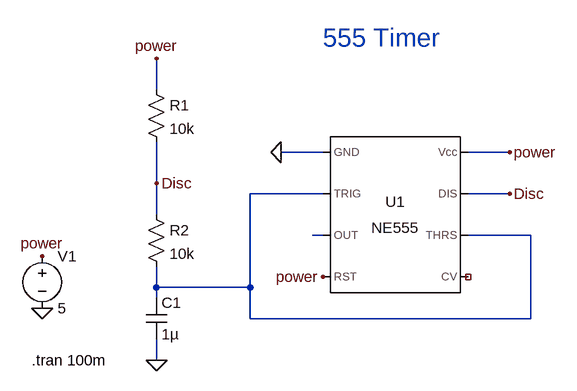
[diagram p0: schematic 555-timer.asc]
555-timer.asc, the LTspice schematic file:
Version 4.1
SHEET 1 880 680
WIRE -48 -16 -48 -64
WIRE 208 80 144 80
WIRE 496 80 432 80
WIRE -48 128 -48 64
WIRE 208 144 96 144
WIRE 496 144 432 144
WIRE -48 176 -48 128
WIRE 208 208 192 208
WIRE 528 208 432 208
WIRE -48 288 -48 256
WIRE 96 288 96 144
WIRE 96 288 -48 288
WIRE -48 304 -48 288
WIRE 96 336 96 288
WIRE 528 336 528 208
WIRE 528 336 96 336
WIRE -48 400 -48 368
FLAG -48 400 0
FLAG -224 320 0
FLAG -224 240 power
FLAG 496 80 power
FLAG 208 272 power
FLAG -48 -64 power
FLAG 144 80 0
FLAG -48 128 Disc
FLAG 496 144 Disc
SYMBOL Misc\\NE555 320 176 R0
SYMATTR InstName U1
SYMBOL res -64 -32 R0
SYMATTR InstName R1
SYMATTR Value 10k
SYMBOL res -64 160 R0
SYMATTR InstName R2
SYMATTR Value 10k
SYMBOL cap -64 304 R0
SYMATTR InstName C1
SYMATTR Value 1µ
SYMBOL voltage -224 224 R0
WINDOW 123 0 0 Left 2
WINDOW 39 0 0 Left 2
SYMATTR InstName V1
SYMATTR Value 5
TEXT -240 400 Left 2 !.tran 100m
TEXT 208 -96 Left 4 ;555 Timer

The netlist it stands for:
* 555-timer.asc
X§U1 0 N001 N002 power NC_01 N001 Disc power NE555  ; pins GND TRIG OUT RST CV THRS DIS Vcc
R1 power Disc 10k
R2 Disc N001 10k
C1 N001 0 1µ
V1 power 0 5
.tran 100m
* 555 Timer
.lib NE555.sub
.backanno
.end